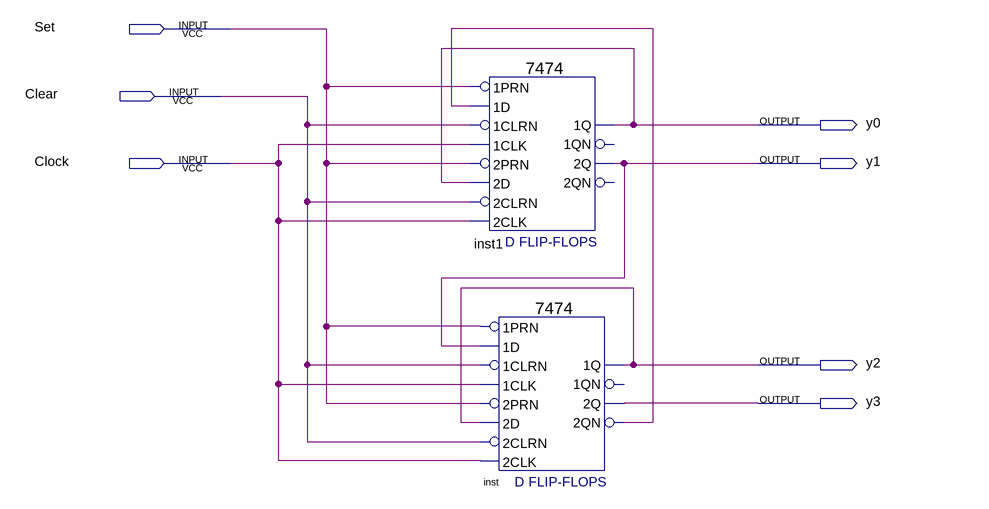
[diagram p0: schematic sheet]
// Quartus schematic twistedcounter.bdf as structural Verilog: 2 symbols, 7 pins
module twistedcounter (
  input  Set,
  input  Clear,
  input  Clock,
  output y0,
  output y1,
  output y2,
  output y3
);

  wire inst_2qn;

  \7474  inst1 (
    .\2D (y0), .\2PRN (Set), .\1CLK (Clock), .\1D (inst_2qn), .\1PRN (Set), .\2CLK (Clock), .\2CLRN (Clear),
    .\1CLRN (Clear), .\2Q (y1), .\1Q (y0));  // open: 1QN, 2QN
  \7474  inst (
    .\2D (y2), .\2PRN (Set), .\1CLK (Clock), .\1D (y1), .\1PRN (Set), .\2CLK (Clock), .\2CLRN (Clear),
    .\1CLRN (Clear), .\2Q (y3), .\2QN (inst_2qn), .\1Q (y2));  // open: 1QN
endmodule
